# EAGLE design ncp5623c-breakout (EAGLE 9.6.2)
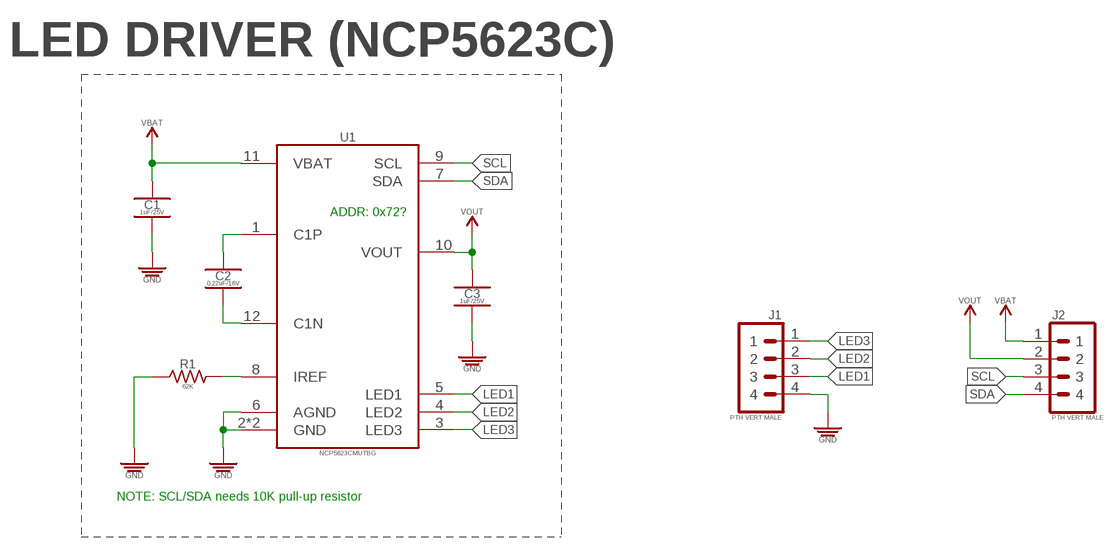
[diagram p0: schematic, sheet 1]

## Parts
C1  1uF/25V  1UF_CER_SMD-0402_25V-10%  [CAPC1005X55_SMD-0402]
C2  0.22uF/16V  0.22UF_CER_SMD_0402_16V-10%  [CAPC1005X55_SMD-0402]
C3  1uF/25V  1UF_CER_SMD-0402_25V-10%  [CAPC1005X55_SMD-0402]
J1  PTH VERT MALE  1X04_PTH_VERT_MALE_2.54MM  [HDRV4W64P254_1X4_1016X254X838B]
J2  PTH VERT MALE  1X04_PTH_VERT_MALE_2.54MM  [HDRV4W64P254_1X4_1016X254X838B]
R1  62K  62KΩ_SMD-0402_1/16W-5%  [RESC1005X35_SMD-0402]
U1  NCP5623CMUTBG  [SON40P200X200X80-11T57X90N]

## Nets
GND: C1.2 C3.2 J1.4 R1.1 U1.2(GND) U1.6(AGND) U1.EP(GND)
LED1: J1.3 U1.5(LED1)
LED2: J1.2 U1.4(LED2)
LED3: J1.1 U1.3(LED3)
N$1: C2.2 U1.12(C1N)
N$2: C2.1 U1.1(C1P)
N$3: R1.2 U1.8(IREF)
SCL: J2.3 U1.9(SCL)
SDA: J2.4 U1.7(SDA)
VBAT: C1.1 J2.1 U1.11(VBAT)
VOUT: C3.1 J2.2 U1.10(VOUT)

## Notes on the sheet
- LED DRIVER (NCP5623C)
- ADDR: 0x72?
- NOTE: SCL/SDA needs 10K pull-up resistor

## Library data of the parts
C1 C3 = _capacitors:1UF; DATASHEET: https://product.tdk.com/info/en/catalog/datasheets/mlcc_commercial_lowprofile_en.pdf; DIST: Digikey; DISTLINK: https://www.digikey.com/products/en?keywords=445-13185-1-ND; DISTPN: 445-13185-1-ND; MFR: TDK Corporation; MPN: CGB2A1X5R1E105K033BC
C2 = _capacitors:0.22UF: 0.22µF ±10% 50V Ceramic Capacitor X5R 0402 (1005 Metric); DATASHEET: https://product.tdk.com/info/en/documents/chara_sheet/CGA2B1X5R1C224K050BC.pdf; DIST: Digikey; DISTLINK: https://www.digikey.com/products/en?keywords=445-7877-1-ND; DISTPN: 445-7877-1-ND; MFR: TDK Corporation; MPN: CGA2B1X5R1C224K050BC
J1 J2 = _connectors:1X04; DATASHEET: https://drawings-pdf.s3.amazonaws.com/C10436.pdf; DIST: Digikey; DISTLINK: https://www.digikey.com/products/en?keywords=PEC04SAAN; DISTPN: S1012E-04-ND; MFR: Sullins Connector Solutions; MPN: PEC04SAAN
R1 = _resistors:62KΩ; DATASHEET: https://www.yageo.com/upload/media/product/productsearch/datasheet/rchip/PYu-RC_Group_51_RoHS_L_11.pdf; DIST: Digikey; DISTLINK: https://www.digikey.com/en/products/detail/yageo/RC0402JR-0762KL/726499?s=N4IgTCBcDaIMwEYEFoBsYDSApASgYQBVkA5AERAF0BfIA; DISTPN: 311-62KJRCT-ND; MFR: Yageo; MPN: RC0402JR-0762KL
U1 = _special:NCP5623C: IC LED DRIVER RGLTR 30MA 12LLGA LED Driver IC 3 Output DC DC Regulator Switched Capacitor (Charge Pump) I²C, PWM Dimming 30mA 12-LLGA (2x2); DATASHEET: https://www.onsemi.com/pub/Collateral/NCP5623C-D.PDF; DIST: Digikey; DISTLINK: https://www.digikey.com/en/products/detail/on-semiconductor/NCP5623CMUTBG/2194146?s=N4IgTCBcDaIHIGEAKBWAbGAzAgsgVQBUAhAcQHkBlBAgWjgBEQBdAXyA; DISTPN: NCP5623CMUTBGOSCT-ND; MFR: ON Semiconductor; MPN: NCP5623CMUTBG

## Board
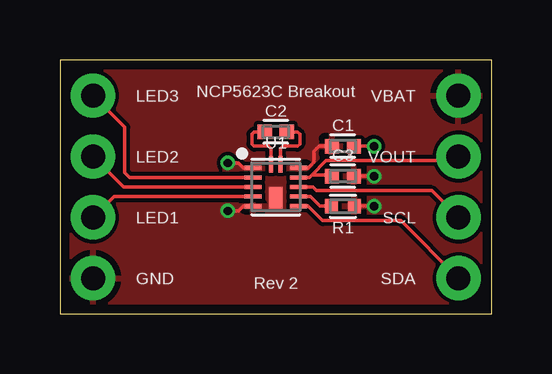
[diagram p1: board, top side]
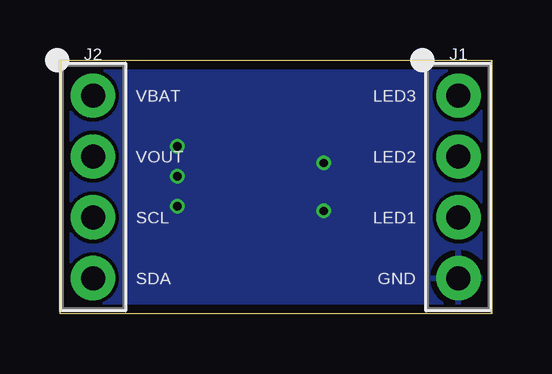
[diagram p2: board, bottom side, seen from below]

Size 18 x 10.6 mm. Coordinates in mm from the lower left corner, seen from the top.
Outline: 0,0 18,0 18,10.6 0,10.6 0,0
Copper layers (1*16): Top 0.035559375mm / dielectric 1.6mm / Bottom 0.035559375mm
Design rules "oshpark-2layer": minimum track width 6mil, minimum drill 10mil, track to track 6mil, track to pad 6mil, pad to pad 6mil, via to via 6mil, smd to smd 6mil, copper to edge 15mil, drill to drill 6mil, minimum pad ring 5mil, minimum via ring 5mil, stop-mask expansion 2.5mil, vias tented up to drill 0mil, thermal gap 10mil

### Footprints (pad centres in the part's own frame; a part is rotated, then mirrored left to right if it is on the bottom)
CAPC1005X55_SMD-0402 = smd 0.585 x 0.612: 1 -0.458,0; 2 0.458,0
HDRV4W64P254_1X4_1016X254X838B = drill 1 pad 1.85: 1 -3.81,0; 2 -1.27,0; 3 1.27,0; 4 3.81,0
RESC1005X35_SMD-0402 = smd 0.535 x 0.6: 1 -0.482,0; 2 0.482,0
SON40P200X200X80-11T57X90N = smd 0.175 x 0.7: 1 -0.2,0.95; 12 0.2,0.95 | smd 0.7 x 0.175: 2 -0.95,0.8; 3 -0.95,0.4; 4 -0.95,0; 5 -0.95,-0.4; 6 -0.95,-0.8; 7 0.95,-0.8; 8 0.95,-0.4; 9 0.95,0; 10 0.95,0.4; 11 0.95,0.8 | smd 0.575 x 0.9: EP 0,-0.45

### Placement (x,y rotation side)
C1  11.8,7 0 top
C2  9,7.6 0 top
C3  11.8,5.75 0 top
J1  1.38,5.3 270 bottom
J2  16.62,5.3 270 bottom
R1  11.8,4.5 180 top
U1  9,5.3 0 top

### Tracks (layer width: path | path; a pad name or v marks a point on that pad's centre or on a via)
GND  (via drill 0.35 pad 0.15)
  Top 0.152: v7,6.3 7.45,6.3 7.65,6.1 U1.2 | U1.6 7.65,4.5 7.45,4.3 v7,4.3 | C1.2 v13.1,7 | C3.2 v13.1,5.75 | R1.1 v13.1,4.5
  pour Bottom (rank 6): 0,0 18,0 18,10.6 0,10.6
  pour Top (rank 5): 0,0 18,0 18,6.4 0,6.4
LED1
  Top 0.152: J1.3 2.25,4.9 U1.5
LED2
  Top 0.152: J1.2 2.65,5.3 U1.4
LED3
  Top 0.152: J1.1 2.7,7.79 2.7,5.9 2.9,5.7 U1.3
N$1
  Top 0.152: C2.2 9.9,7.6 10,7.5 10,7.1 9.9,7 9.3,7 9.2,6.9 U1.12
N$2
  Top 0.152: C2.1 8.1,7.6 8,7.5 8,7.1 8.1,7 8.7,7 8.8,6.9 U1.1
N$3
  Top 0.152: U1.8 10.45,4.9 10.85,4.5 R1.2
SCL
  Top 0.152: U1.9 10.55,5.3 10.7,5.15 15.5,5.15 J2.3
SDA
  Top 0.152: U1.7 10.35,4.5 10.95,3.9 14.21,3.9 J2.4
VBAT
  Top 0.152: U1.11 10.35,6.1 10.6,6.35 10.6,6.8 10.8,7 C1.1
  pour Top: 0,5.7 10.4,5.7 11.1,6.4 18,6.4 18,10.6 0,10.6
VOUT
  Top 0.152: U1.10 10.4,5.7 10.5,5.8 | 10.5,5.8 11.1,6.4 16.45,6.4 J2.2 | C3.1 11.29,5.8 10.5,5.8

### Text on the board
tPlace: LED3 | NCP5623C Breakout | VBAT | LED2 | VOUT | LED1 | SCL | GND | Rev 2 | SDA
bPlace: LED3 | VBAT | LED2 | VOUT | LED1 | SCL | GND | SDA